# Altium schematic sheet 1_Power.SchDoc
size A4; SheetNumber: 2; SheetTotal: 12; SPICEModelCacheZZLNYIBB: <root> / <DocumentId>ZZLNYIBB</DocumentId> / </root>
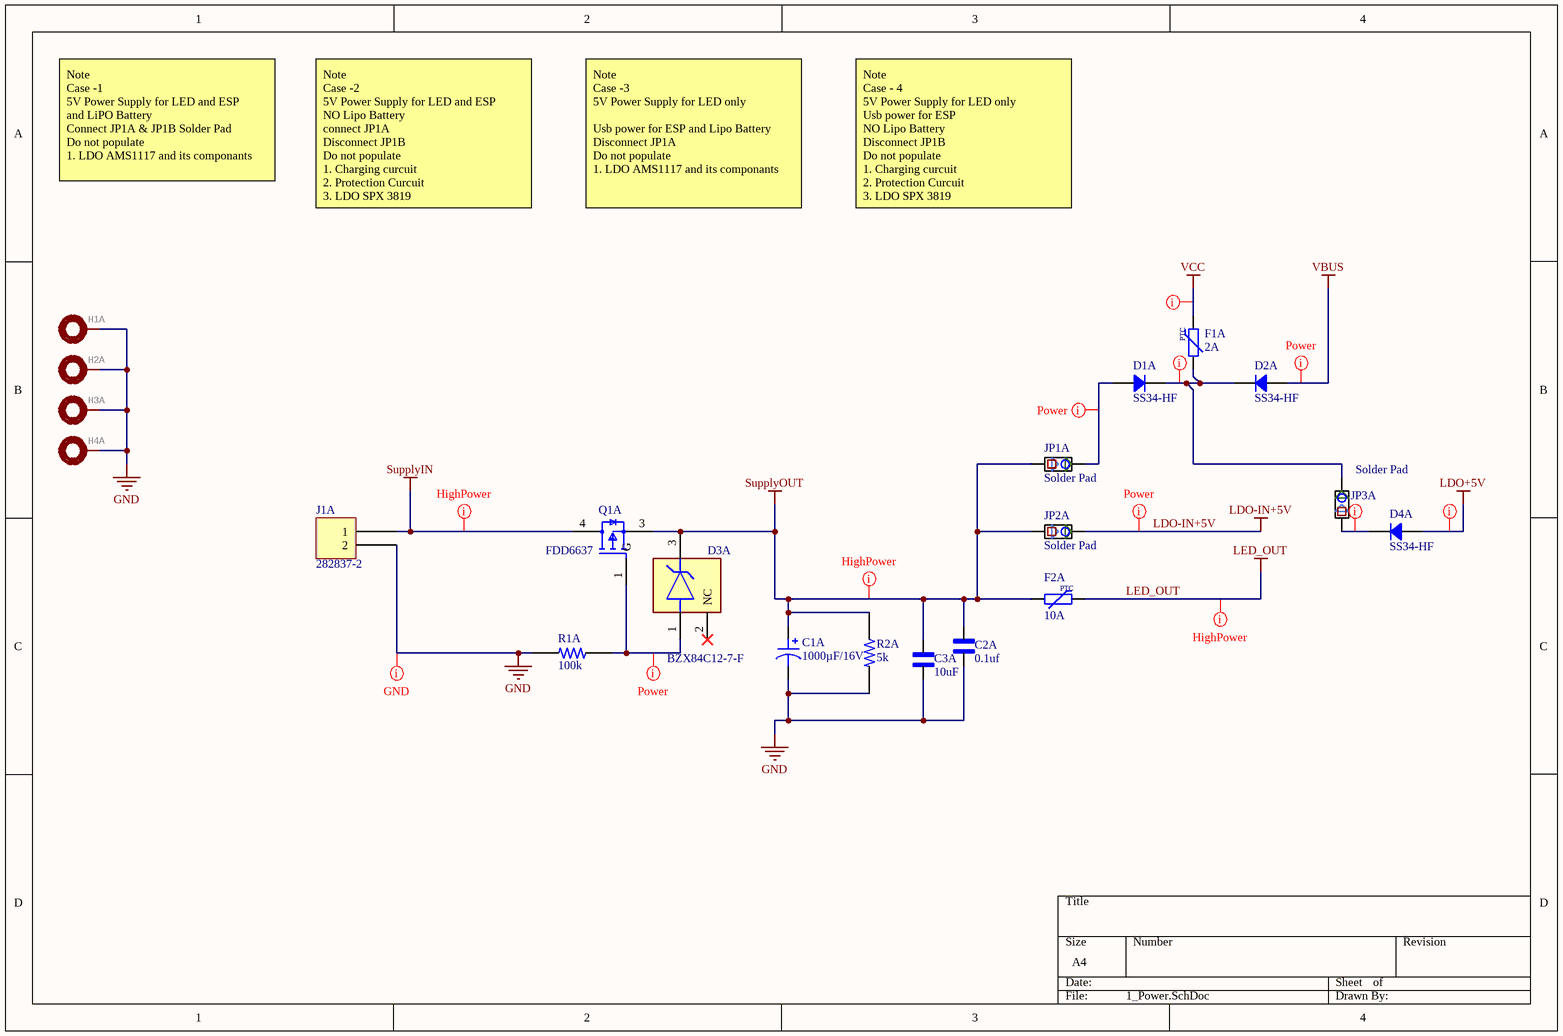
[diagram p0: 1_Power.SchDoc]

## Parts
C1A  1000µF/16V  [CAP TH ALUM ELEC D10.00mm S5.00mm H17.50mm]
C2A  0.1uf  [C-0603]
C3A  10uF  [C-0603]
D1A  SS34-HF  [DO214AC SMA]
D2A  SS34-HF  [DO214AC SMA]
D3A  BZX84C12-7-F  [FP-SOT23-MFG]
D4A  SS34-HF  [DO214AC SMA]
F1A  2A  [FUSE_1206]
F2A  10A  [FUSE_1206]
H1A  MOUNTING PAD, round  [2,4-PAD]  (value not drawn)
H2A  MOUNTING PAD, round  [2,4-PAD]  (value not drawn)
H3A  MOUNTING PAD, round  [2,4-PAD]  (value not drawn)
H4A  MOUNTING PAD, round  [2,4-PAD]  (value not drawn)
J1A  282837-2  [TE 282837-2]
JP1A  Solder Pad  [Solder_Pad_2_Pin_NC_Medium]
JP2A  Solder Pad  [Solder_Pad_2_Pin_NC_Medium]
JP3A  Solder Pad  [Solder_Pad_2_Pin_NC_Medium]
Q1A  FDD6637  [FP-369AS-MFG]
R1A  100k  [R-0603]
R2A  5k  [R-0603]

## Nets
GND: C1A.2 C2A.1 C3A.1 H1A.1(MOUNT) H2A.1(MOUNT) H3A.1(MOUNT) H4A.1(MOUNT) J1A.2 R1A.2 R2A.2
LDO+5V: D4A.1
LDO-IN+5V: JP2A.2
LED_OUT: F2A.2
SupplyIN: J1A.1 Q1A.4(D)
SupplyOUT: C1A.1 C2A.2 C3A.2 D3A.3(C) F2A.1 JP1A.1 JP2A.1 Q1A.3(S) R2A.1
VBUS: D2A.1
VCC: F1A.2
NetD1A_1: D1A.1 JP1A.2
NetD1A_2: D1A.2 D2A.2 F1A.1 JP3A.2
NetD3A_1: D3A.1(A) Q1A.1(G) R1A.1
NetD4A_2: D4A.2 JP3A.1

Not connected (* = marked no-connect by the designer): D3A 2(NC)*

## Layout directives
net class HighPower; rule Supply Nets [Voltage = 0.000]: LED_OUT, SupplyIN, SupplyOUT
net class GND; rule Supply Nets [Voltage = 0.000]: GND
net class Power: NetD1A_1
net class Power; rule Supply Nets [Voltage = 0.000]: LDO+5V, LDO-IN+5V, NetD1A_2, NetD3A_1, NetD4A_2, VBUS, VCC

## Notes on the sheet
- Note
  Case -1
  5V Power Supply for LED and ESP
  and LiPO Battery
  Connect JP1A & JP1B Solder Pad
  Do not populate
  1. LDO AMS1117 and its componants
- Note
  Case -2
  5V Power Supply for LED and ESP
  NO Lipo Battery
  connect JP1A
  Disconnect JP1B
  Do not populate
  1. Charging curcuit
  2. Protection Curcuit
  3. LDO SPX 3819
- Note
  Case -3
  5V Power Supply for LED only
  Usb power for ESP and Lipo Battery
  Disconnect JP1A
  Do not populate
  1. LDO AMS1117 and its componants
- Note
  Case - 4
  5V Power Supply for LED only
  Usb power for ESP
  NO Lipo Battery
  Disconnect JP1B
  Do not populate
  1. Charging curcuit
  2. Protection Curcuit
  3. LDO SPX 3819
- (in symbol FUSE_PPTC_1206) PTC

## Library data of the parts
C1A = EEU-FK1C102: AL LYTIC, RADIAL, 16VDC, 1000UF; manufacturer: Panasonic Electronic Components; Capacitance: 1000µF; Impedance: 49 mOhms; Lifetime @ Temp.: 4000 Hrs @ 105°C; Polarization: Polar; Ripple Current @ High Frequency: 1.24A @ 100kHz; Ripple Current @ Low Frequency: 930mA @ 120Hz; Tolerance: ±20%; Voltage - Rated: 16V; Part Number: EEU-FK1C102; Applications: Automotive; componentlink1description: Datasheet; componentlink1url: https://industrial.panasonic.com/cdbs/www-data/pdf/RDF0000/ABA0000C1015.pdf; componentlink2description: DigiKey Link; componentlink2url: http://digikey.com/product-detail/en/panasonic-electronic-components/EEU-FK1C102/P124274-ND/9921223; Device Package: Radial, Can; Height - Seated (Max): 0.689" (17.50mm); lastupdated: 02-09-2020 01:31:24 AM; Lead Spacing: 0.197" (5.00mm); Lifecycle Status: Active; Minimum Order: 1; Mounting Type: Through Hole; Operating Temperature: -55°C ~ 105°C; Package / Case: Radial, Can; packaging: Bulk; partid: 11906; Part Status: Active; price: 0.83; Ratings: AEC-Q200; series: FK; Size / Dimension: 0.394" Dia (10.00mm); Supplier 1: DigiKey; Supplier Part Number 1: P124274-ND; value: 1000µF/16V
C2A C3A = C-0603: Ceramic Capacitor 16V 0603 (1608 Metric); MP: C0603C104J4RAC; MF: KEMET; SnapEDA_Link: https://www.snapeda.com/parts/C0603C104J4RAC/KEMET/view-part/1763758/?ref=snap; Availability: Warning; Package: 0603 KEMET; Check_prices: https://www.snapeda.com/parts/C0603C104J4RAC/KEMET/view-part/1763758/?ref=eda; Value: *; Price: None
D1A D2A D4A = SS34-HF: DIODE SCHOTTKY 40V 3A DO214AC; Manufacturer: Comchip Technology; Capacitance @ Vr, F: 450pF @ 4V, 1MHz; Current - Reverse Leakage @ Vr: 500 µA @ 40 V; Speed: Fast Recovery =< 500ns, > 200mA (Io); Voltage - Forward (Vf) (Max) @ If: 550 mV @ 3 A; Part Number: SS34-HF; ComponentLink1Description: Datasheet; ComponentLink1URL: http://www.comchiptech.com/admin/files/product/20190514101641.pdf; ComponentLink2Description: DigiKey Link; ComponentLink2URL: https://www.digikey.com/en/products/detail/comchip-technology/SS34-HF/10279693; Current - Average Rectified (Io): 3A; Diode Type: Schottky; LastUpdated: 30-12-2022 08:53:12 PM; Lifecycle Status: Active; Minimum Order: 1; Mounting Type: Surface Mount; Operating Temperature - Junction: -55°C ~ 125°C; Package / Case: DO-214AC, SMA; Packaging: TapeAndReel; PartId: 2138; Part Status: Active; Price: 0.07; Series: -; Supplier 1: DigiKey; Supplier Part Number 1: 641-2115-1-ND; Supplier Device Package: DO-214AC (SMA); Voltage - DC Reverse (Vr) (Max): 40 V
D3A = CMP-12792-000017-1: DIODE ZENER 12V 300MW SOT23-3; Manufacturer: Diodes Inc.; Max Reverse Leakage Current: 0.1uA; Max Zener Voltage: 12.7V; Reverse Voltage: 8V; Zener Impedance: 25Ω; Max Junction Temp: +150°C; Standoff Height: 0.013mm; Height: 1.1mm; RoHS: TRUE; Manufacturer Part Number: BZX84C12-7-F; Digikey Description: DIODE ZENER 12V 300MW SOT23-3; Device Class L2: Diodes; Power Dissipation: 300mW; Category: Diode; Device Class L3: Zener Diodes; Footprint Url: https://www.diodes.com/assets/Package-Files/SOT23.pdf; Nom Zener Voltage: 12V; Temperature: -65°C to +150°C; ComponentLink2Description: Datasheet; Lead Free: Yes; ComponentLink2URL: https://www.diodes.com/assets/Datasheets/ds18001.pdf; Mouser Description: Zener Diodes 12V 350mW; Temperature Range Low: -65°C; Automotive: No; Package: SOT23; Ipc Land Pattern Name: SOT92P240X102-3; Temperature Range High: +150°C; Octopart: https://octopart.com/bzx84c12-7-f-diodes+inc.-327696; Device Class L1: Discrete Semiconductors
F1A F2A = FUSE_PPTC_1206: Fuse PPTC SMD 1206; Manufacturer: *; Manufacturer Part Number: *
H1A H2A H3A H4A = MOUNT-PAD-ROUND2.4: GateName_1: G$1; DeviceName: 2.8; POPULARITY: 6; SymbolName_1: MOUNT-PAD; LibraryName: Holes-Custom; DeviceSetName: MOUNT-PAD-ROUND; Package: 2,8-PAD
J1A = 282837-2: TERM BLK 2P SIDE ENT 5.08MM PCB; Manufacturer: TE Connectivity AMP Connectors; Pitch: 0.200" (5.08mm); Current: 13.5 A; Mating Orientation: Horizontal with Board; Number of Levels: 1; Positions Per Level: 2; Voltage: 300 V; Wire Gauge: 16-28 AWG; Wire Termination: Screw - Rising Cage Clamp; Packaging: Tray; Part Number: 282837-2; Color: Green; ComponentLink1Description: Datasheet; ComponentLink1URL: https://www.te.com/commerce/DocumentDelivery/DDEController?Action=srchrtrv&DocNm=282837&DocType=Customer+Drawing&DocLang=English; ComponentLink2Description: DigiKey Link; ComponentLink2URL: https://www.digikey.com/en/products/detail/te-connectivity-amp-connectors/282837-2/2187973; Features: Interlocking (Side); LastUpdated: 21-06-2022 03:00:23 PM; Lifecycle Status: Active; Minimum Order: 1; Mounting Type: Through Hole; Part Status: Active; Price: 0.31; Series: Buchanan; Supplier 1: DigiKey; Supplier Part Number 1: A113320-ND
JP1A JP2A JP3A = Solder_Pad_2_Pin_NC_Medium: Solder Pad 2 Pin NC 1.016 mm Pitch
Q1A = CMP-07173-000090-1: MOSFET P-CH 35V 13A DPAK; Manufacturer: ON Semiconductor; Threshold Vgs Max: -3V; Transconductance: 35S; Rthja Max: 96°C/W; Pulse Drain Current: -100A; Reverse Recovery Time: 28ns; Number Of P Channels: 1; Drain To Source Voltage: -35V; Turn On Delay Time: 18ns; Depletion Mode: False; Turn Off Delay Time: 62ns; Max Junction Temp: +150°C; Gate To Source Voltage: 25V; Gate Charge At Vgs: 45nC @ -10V; Threshold Vgs Min: -1V; Drain To Source Resistance: 9.7mΩ; Power Dissipation: 1.3W; Typ Forward Diode Voltage: -0.8V; Input Capacitace At Vds: 2370pF @ -20V; Max Forward Diode Voltage: -1.2V; Continuous Drain Current: -13A; Reverse Recovery Charge: 15nC; Temperature: -55°C to +150°C; Package: 369AS; Device Class L2: Transistors; Automotive: No; ComponentLink2URL: https://www.onsemi.com/pub/Collateral/FDD6637-D.pdf; Temperature Range Low: -55°C; Manufacturer Part Number: FDD6637; Number Of Channels: 1; Lead Free: Yes; Temperature Range High: +150°C; ComponentLink2Description: Datasheet; RoHS: TRUE; Octopart: https://octopart.com/fdd6637-on+semiconductor-84325825; Drain To Source Breakdown Voltage: -35V; Footprint Url: https://www.onsemi.com/pub/Collateral/369AS.PDF; Category: Trans; Device Class L1: Discrete Semiconductors; Digikey Description: MOSFET P-CH 35V 13A DPAK; Device Class L3: MOSFETs; Mouser Description: MOSFET 35V PCH PowerTrench MOSFET; Height: 2.517mm
R1A R2A = R-0603: 0603; MP: 2-1623703-0; Power_Rating: .1 W; Value: 10K; Tolerance: 1%; MF: TE Connectivity; Package: 0603; Price: None; Resistance: 10K; Check_prices: https://www.snapeda.com/parts/2-1623703-0/TE%20Connectivity/view-part/2213192/?ref=eda; SnapEDA_Link: https://www.snapeda.com/parts/2-1623703-0/TE%20Connectivity/view-part/2213192/?ref=snap; Availability: Warning